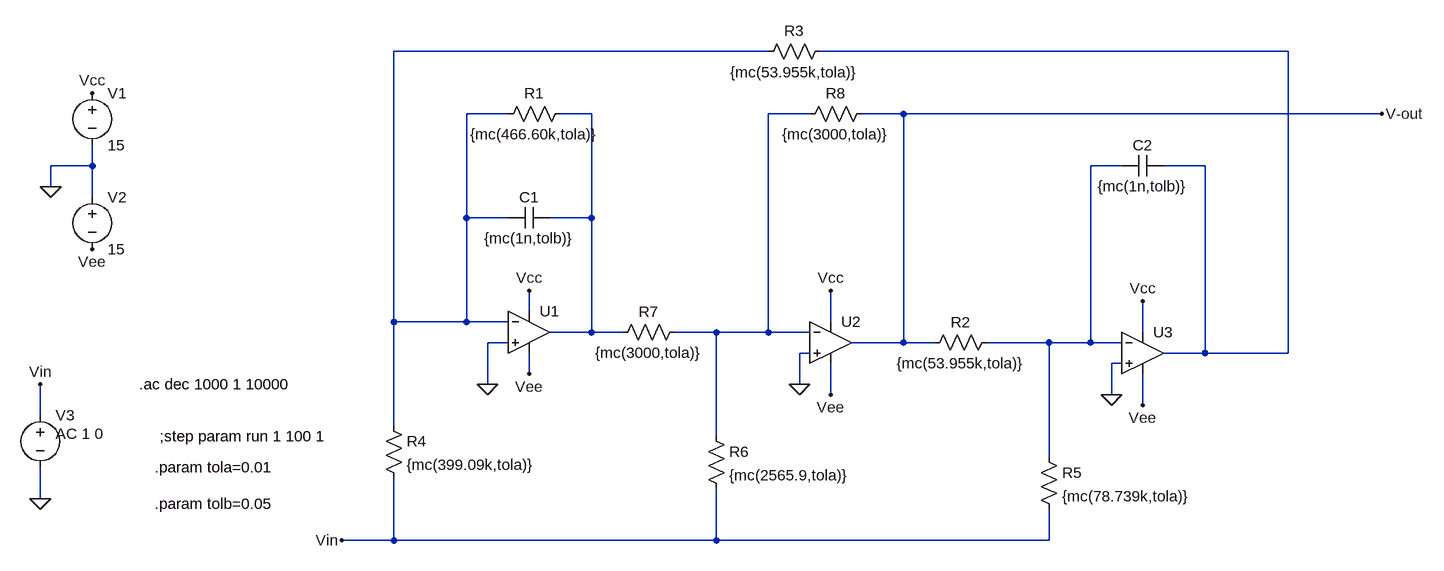
[diagram p0: schematic Fleischer-Tow 2.asc]
Fleischer-Tow 2.asc, the LTspice schematic file:
Version 4
SHEET 1 1672 680
WIRE 384 -528 -192 -528
WIRE 1184 -528 464 -528
WIRE -16 -432 -80 -432
WIRE 112 -432 64 -432
WIRE 448 -432 384 -432
WIRE 592 -432 528 -432
WIRE 1328 -432 592 -432
WIRE -656 -352 -656 -384
WIRE -656 -352 -720 -352
WIRE 928 -352 880 -352
WIRE 1056 -352 992 -352
WIRE -720 -320 -720 -352
WIRE -656 -304 -656 -352
WIRE -80 -272 -80 -432
WIRE -16 -272 -80 -272
WIRE 112 -272 112 -432
WIRE 112 -272 48 -272
WIRE 16 -128 16 -160
WIRE -192 -112 -192 -528
WIRE -80 -112 -80 -272
WIRE -80 -112 -192 -112
WIRE -16 -112 -80 -112
WIRE 480 -112 480 -160
WIRE 112 -96 112 -272
WIRE 112 -96 48 -96
WIRE 160 -96 112 -96
WIRE 304 -96 240 -96
WIRE 384 -96 384 -432
WIRE 384 -96 304 -96
WIRE 448 -96 384 -96
WIRE 960 -96 960 -144
WIRE -16 -80 -48 -80
WIRE 592 -80 592 -432
WIRE 592 -80 512 -80
WIRE 640 -80 592 -80
WIRE 816 -80 720 -80
WIRE 880 -80 880 -352
WIRE 880 -80 816 -80
WIRE 928 -80 880 -80
WIRE 448 -64 432 -64
WIRE 1056 -64 1056 -352
WIRE 1056 -64 992 -64
WIRE 1184 -64 1184 -528
WIRE 1184 -64 1056 -64
WIRE 928 -48 912 -48
WIRE 16 -32 16 -64
WIRE -48 -16 -48 -80
WIRE 432 -16 432 -64
WIRE 480 0 480 -48
WIRE 912 0 912 -48
WIRE 960 16 960 -32
WIRE -736 32 -736 -16
WIRE -192 48 -192 -112
WIRE 304 64 304 -96
WIRE 816 96 816 -80
WIRE -736 160 -736 112
WIRE -192 224 -192 128
WIRE -192 224 -272 224
WIRE 304 224 304 144
WIRE 304 224 -192 224
WIRE 816 224 816 176
WIRE 816 224 304 224
FLAG 912 0 0
FLAG 432 -16 0
FLAG 1328 -432 V-out
FLAG 16 -160 Vcc
FLAG 480 -160 Vcc
FLAG 960 -144 Vcc
FLAG 16 -32 Vee
FLAG 480 0 Vee
FLAG 960 16 Vee
FLAG -656 -464 Vcc
FLAG -656 -224 Vee
FLAG -720 -320 0
FLAG -736 160 0
FLAG -736 -16 Vin
FLAG -48 -16 0
FLAG -272 224 Vin
SYMBOL Opamps\\UniversalOpamp2 16 -96 R0
SYMATTR InstName U1
SYMATTR Value2 Avol=1000Meg GBW=10000Meg Slew=1000Meg
SYMATTR SpiceLine ilimit=50 rail=0 Vos=0 phimargin=45
SYMATTR SpiceLine2 en=0 enk=0 in=0 ink=0 Rin=100000Meg
SYMBOL Opamps\\UniversalOpamp2 480 -80 R0
SYMATTR InstName U2
SYMATTR Value2 Avol=1000Meg GBW=10000Meg Slew=1000Meg
SYMATTR SpiceLine ilimit=50 rail=0 Vos=0 phimargin=45
SYMATTR SpiceLine2 en=0 enk=0 in=0 ink=0 Rin=100000Meg
SYMBOL Opamps\\UniversalOpamp2 960 -64 R0
SYMATTR InstName U3
SYMATTR Value2 Avol=1000Meg GBW=10000Meg Slew=1000Meg
SYMATTR SpiceLine ilimit=50 rail=0 Vos=0 phimargin=45
SYMATTR SpiceLine2 en=0 enk=0 in=0 ink=0 Rin=100000Meg
SYMBOL res 80 -448 R90
WINDOW 0 0 56 VBottom 2
WINDOW 3 32 56 VTop 2
SYMATTR InstName R1
SYMATTR Value {mc(466.60k,tola)}
SYMBOL res 256 -112 R90
WINDOW 0 0 56 VBottom 2
WINDOW 3 32 56 VTop 2
SYMATTR InstName R7
SYMATTR Value {mc(3000,tola)}
SYMBOL res 736 -96 R90
WINDOW 0 0 56 VBottom 2
WINDOW 3 32 56 VTop 2
SYMATTR InstName R2
SYMATTR Value {mc(53.955k,tola)}
SYMBOL voltage -656 -480 R0
WINDOW 123 0 0 Left 2
WINDOW 39 0 0 Left 2
SYMATTR InstName V1
SYMATTR Value 15
SYMBOL voltage -656 -320 R0
WINDOW 123 0 0 Left 2
WINDOW 39 0 0 Left 2
SYMATTR InstName V2
SYMATTR Value 15
SYMBOL voltage -736 16 R0
WINDOW 123 24 44 Left 2
WINDOW 39 0 0 Left 2
SYMATTR Value2 AC 1 0
SYMATTR InstName V3
SYMATTR Value ""
SYMBOL cap 48 -288 R90
WINDOW 0 0 32 VBottom 2
WINDOW 3 32 32 VTop 2
SYMATTR InstName C1
SYMATTR Value {mc(1n,tolb)}
SYMBOL res 480 -544 R90
WINDOW 0 0 56 VBottom 2
WINDOW 3 32 56 VTop 2
SYMATTR InstName R3
SYMATTR Value {mc(53.955k,tola)}
SYMBOL res 544 -448 R90
WINDOW 0 0 56 VBottom 2
WINDOW 3 32 56 VTop 2
SYMATTR InstName R8
SYMATTR Value {mc(3000,tola)}
SYMBOL cap 992 -368 R90
WINDOW 0 0 32 VBottom 2
WINDOW 3 32 32 VTop 2
SYMATTR InstName C2
SYMATTR Value {mc(1n,tolb)}
SYMBOL res -208 32 R0
SYMATTR InstName R4
SYMATTR Value {mc(399.09k,tola)}
SYMBOL res 288 48 R0
SYMATTR InstName R6
SYMATTR Value {mc(2565.9,tola)}
SYMBOL res 800 80 R0
SYMATTR InstName R5
SYMATTR Value {mc(78.739k,tola)}
TEXT -584 -16 Left 2 !.ac dec 1000 1 10000
TEXT -552 64 Left 2 !;step param run 1 100 1
TEXT -560 112 Left 2 !.param tola=0.01
TEXT -560 168 Left 2 !.param tolb=0.05

The netlist it stands for:
* Fleischer-Tow 2.asc
XU1 0 N001 Vcc Vee N003 level.2 Avol=1000Meg GBW=10000Meg Slew=1000Meg ilimit=50 rail=0 Vos=0 phimargin=45 en=0 enk=0 in=0 ink=0 Rin=100000Meg  ; pins IN+ IN- V+ V- OUT
XU2 0 N004 Vcc Vee V-out level.2 Avol=1000Meg GBW=10000Meg Slew=1000Meg ilimit=50 rail=0 Vos=0 phimargin=45 en=0 enk=0 in=0 ink=0 Rin=100000Meg  ; pins IN+ IN- V+ V- OUT
XU3 0 N005 Vcc Vee N002 level.2 Avol=1000Meg GBW=10000Meg Slew=1000Meg ilimit=50 rail=0 Vos=0 phimargin=45 en=0 enk=0 in=0 ink=0 Rin=100000Meg  ; pins IN+ IN- V+ V- OUT
R1 N003 N001 {mc(466.60k,tola)}
R7 N004 N003 {mc(3000,tola)}
R2 N005 V-out {mc(53.955k,tola)}
V1 Vcc 0 15
V2 0 Vee 15
V3 Vin 0 AC 1 0
C1 N003 N001 {mc(1n,tolb)}
R3 N002 N001 {mc(53.955k,tola)}
R8 V-out N004 {mc(3000,tola)}
C2 N002 N005 {mc(1n,tolb)}
R4 N001 Vin {mc(399.09k,tola)}
R6 N004 Vin {mc(2565.9,tola)}
R5 N005 Vin {mc(78.739k,tola)}
.ac dec 1000 1 10000
;step param run 1 100 1
.param tola=0.01
.param tolb=0.05
.lib UniversalOpamps2.sub
.backanno
.end